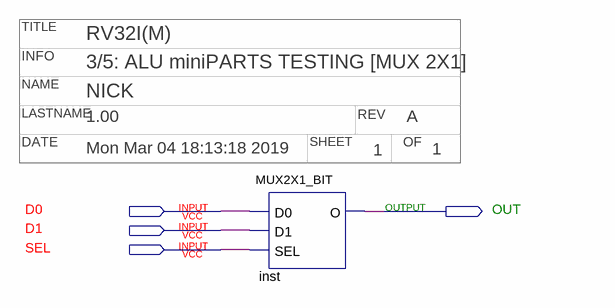
[diagram p0: schematic sheet]
// Quartus schematic MUX2X1_BITTEST.bdf as structural Verilog: 1 symbols, 4 pins
// Title block: TITLE: RV32I(M); INFO: 3/5: ALU miniPARTS TESTING [MUX 2X1]; NAME: NICK; LASTNAME: 1.00; REV: A; DATE: Mon Mar 04 18:13:18 2019; SHEET: 1; OF: 1
module MUX2X1_BITTEST (
  input  D0,
  input  D1,
  input  SEL,
  output OUT
);

  MUX2X1_BIT inst (.D0(D0), .D1(D1), .SEL(SEL), .O(OUT));
endmodule
